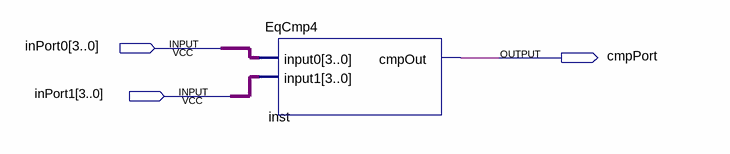
[diagram p0: schematic sheet]
// Quartus schematic EqCmp4_2.bdf as structural Verilog: 1 symbols, 3 pins
module EqCmp4_2 (
  input  [3:0] inPort0,
  input  [3:0] inPort1,
  output cmpPort
);

  EqCmp4 inst (.input0(inPort0), .input1(inPort1), .cmpOut(cmpPort));
endmodule
